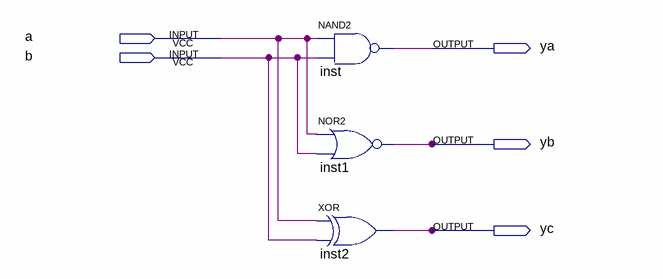
[diagram p0: schematic sheet]
// Quartus schematic logic_mx.bdf as structural Verilog: 3 symbols, 5 pins
module logic_mx (
  input  a,
  input  b,
  output ya,
  output yb,
  output yc
);

  nand inst (ya, a, b);
  nor inst1 (yb, a, b);
  xor inst2 (yc, a, b);
endmodule
